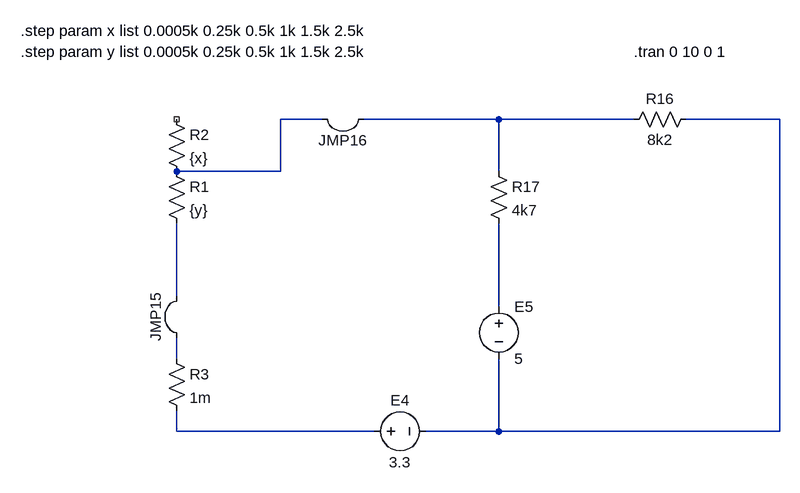
[diagram p0: schematic Draft2.asc]
Draft2.asc, the LTspice schematic file:
Version 4.1
SHEET 1 980 680
WIRE 272 0 208 0
WIRE 544 0 336 0
WIRE 752 0 544 0
WIRE 976 0 832 0
WIRE 208 80 208 0
WIRE 208 80 48 80
WIRE 544 80 544 0
WIRE 48 272 48 160
WIRE 544 288 544 160
WIRE 48 368 48 336
WIRE 48 480 48 448
WIRE 352 480 48 480
WIRE 544 480 544 368
WIRE 544 480 432 480
WIRE 976 480 976 0
WIRE 976 480 544 480
SYMBOL res 32 64 R0
SYMATTR InstName R1
SYMATTR Value {y}
SYMBOL res 32 -16 R0
SYMATTR InstName R2
SYMATTR Value {x}
SYMBOL res 528 64 R0
SYMATTR InstName R17
SYMATTR Value 4k7
SYMBOL res 848 -16 R90
WINDOW 0 0 56 VBottom 2
WINDOW 3 32 56 VTop 2
SYMATTR InstName R16
SYMATTR Value 8k2
SYMBOL voltage 544 272 R0
SYMATTR InstName E5
SYMATTR Value 5
SYMBOL voltage 336 480 R270
WINDOW 0 32 56 VTop 2
WINDOW 3 -32 56 VBottom 2
SYMATTR InstName E4
SYMATTR Value 3.3
SYMBOL Misc\\jumper 304 64 R180
SYMATTR InstName JMP16
SYMBOL Misc\\jumper -16 304 R270
SYMATTR InstName JMP15
SYMBOL res 32 352 R0
SYMATTR InstName R3
SYMATTR Value 1m
TEXT 752 -104 Left 2 !.tran 0 10 0 1
TEXT -192 -136 Left 2 !.step param x list 0.0005k 0.25k 0.5k 1k 1.5k 2.5k
TEXT -192 -104 Left 2 !.step param y list 0.0005k 0.25k 0.5k 1k 1.5k 2.5k

The netlist it stands for:
* Draft2.asc
R1 N001 N003 {y}
R2 NC_01 N001 {x}
R17 N001 N004 4k7
R16 N002 N001 8k2
V§E5 N004 N002 5
V§E4 N005 N002 3.3
R3 N003 N005 1m
.tran 0 10 0 1
.step param x list 0.0005k 0.25k 0.5k 1k 1.5k 2.5k
.step param y list 0.0005k 0.25k 0.5k 1k 1.5k 2.5k
.backanno
.end